# Altium project pwr_switch.PrjPcb
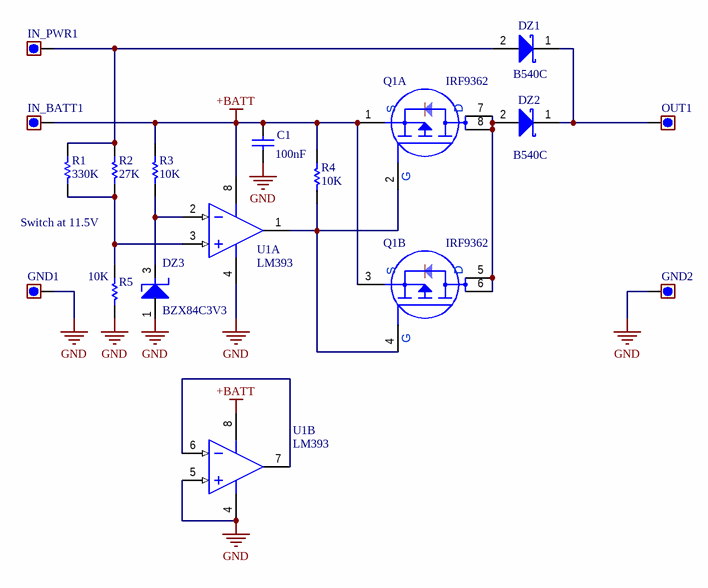
[diagram p0: pwr_switch.SchDoc]
1 sheet, 16 parts. Net scope: global (net labels, ports and power ports of the same name join across sheets).
Board file: pwr_switch.PcbDoc

## Sheet pwr_switch.SchDoc: Shutter interface board
size A3; Author: Francesco Sacchi <batt@develer.com>; Organization: Develer s.r.l.; Address1: via Mugellese 1/A; Address2: 50019 Campi Bisenzio; Address3: Firenze; Address4: ITALY; DocumentNumber: 1; Revision: 0; SheetNumber: 1; SheetTotal: 6

### Parts
C1  100nF  [0603_[1608]]
DZ1  B540C  [DO214AB_K1-A2_SMC]
DZ2  B540C  [DO214AB_K1-A2_SMC]
DZ3  BZX84C3V3  [SOT-23_L]
GND1  (no value)  [PIN1]  (no BOM)
GND2  (no value)  [PIN1]  (no BOM)
IN_BATT1  (no value)  [PIN1]  (no BOM)
IN_PWR1  (no value)  [PIN1]  (no BOM)
OUT1  (no value)  [PIN1]  (no BOM)
Q1  IRF9362  [SOIC8]  (parts A,B of 2)
R1  330K  [0603_[1608]_RES_SMALL]
R2  27K  [0603_[1608]_RES_SMALL]
R3  10K  [0603_[1608]_RES_SMALL]
R4  10K  [0603_[1608]_RES_SMALL]
R5  10K  [0603_[1608]_RES_SMALL]
U1  LM393  [SOIC8]  (parts A,B of 2)

### Nets
+BATT: C1.2 IN_BATT1.1 Q1.1(S) Q1.3(S) R3.2 R4.2 U1.8(VCC)
GND: C1.1 DZ3.1(A) GND1.1 GND2.1 R5.1 U1.4(GND) U1.5(INB+)
NetDZ1_1: DZ1.1(K) DZ2.1(K) OUT1.1
NetDZ1_2: DZ1.2(A) IN_PWR1.1 R1.2 R2.2
NetDZ2_2: DZ2.2(A) Q1.5(D) Q1.6(D) Q1.7(D) Q1.8(D)
NetDZ3_3: DZ3.3(K) R3.1 U1.2(INA-)
NetQ1_2: Q1.2(G) Q1.4(G) R4.1 U1.1(OUTA)
NetR1_1: R1.1 R2.1 R5.2 U1.3(INA+)
NetU1_6: U1.6(INB-) U1.7(OUTB)

### Notes on the sheet
- Switch at 11.5V
- Title:
- Author:
- License:
- BSD
- Rev:
- Size:
- A3
- File:
- Date:
- Time:
- Sheet
- of

### Library data of the parts
C1 = Cap: Capacitor; Published: 8-Jun-2000; Revision: July-2002: Re-released for DXP Platform.; Publisher: Altium Limited; Value: 100nF
DZ1 DZ2 = D Schottky: Diode Schottky (SSC54); Published: 8-Jun-2000; LatestRevisionDate: 17-Jul-2002; LatestRevisionNote: Re-released for DXP Platform.; PackageReference: SMB; Publisher: Altium Limited; PackageDescription: DO-214-AA/SMB; 2 C-Bend Leads; Body 5.3 x 3.6 mm, inc. leads (LxW); Code_JEDEC: DO-214-AA
DZ3 = ZENER_BZX: Zener 0.35W
GND1 GND2 IN_BATT1 IN_PWR1 OUT1 = Test_point
Q1 = MOSFET-P dual: Dual channel P-MOS in same package
R1-R5 = Res1: Resistor; Revision: July-2002: Re-released for DXP Platform.
U1 = LM2903DG: Low Offset Voltage Dual Comparators, 2 to 36 V, -40 to 105 degC, 8-Pin SOIC, Pb-Free, Tube; Manufacturer: On Semiconductor; VCC Min (V): 2; IO Typ (mA): 16; ICC Typ (mA): 0.4; VCC Max (V): 36; PartNumber: LM2903DG; ComponentLink2Description: Datasheet; ComponentLink2URL: http://www.onsemi.com/pub_link/Collateral/LM393-D.PDF; PackageReference: SOIC-8-751-07; ComponentLink1Description: Manufacturer URL; RoHS: TRUE; ComponentLink1URL: http://www.onsemi.com/; ComponentLink3Description: Package Specification; ComponentLink3URL: http://www.onsemi.com/pub_link/Collateral/751-07.PDF; PackageVersion: Rev. AK, 02/2011; DatasheetVersion: Rev. 25; Packing: Tube; Mounting Technology: Surface Mount; PackageDescription: 8-Pin Small Outline Integrated Circuit, Body 4.9 x 3.9 mm, Pitch 1.27 mm